# Altium project GenericPiHAT 06-1.0.PrjPCB
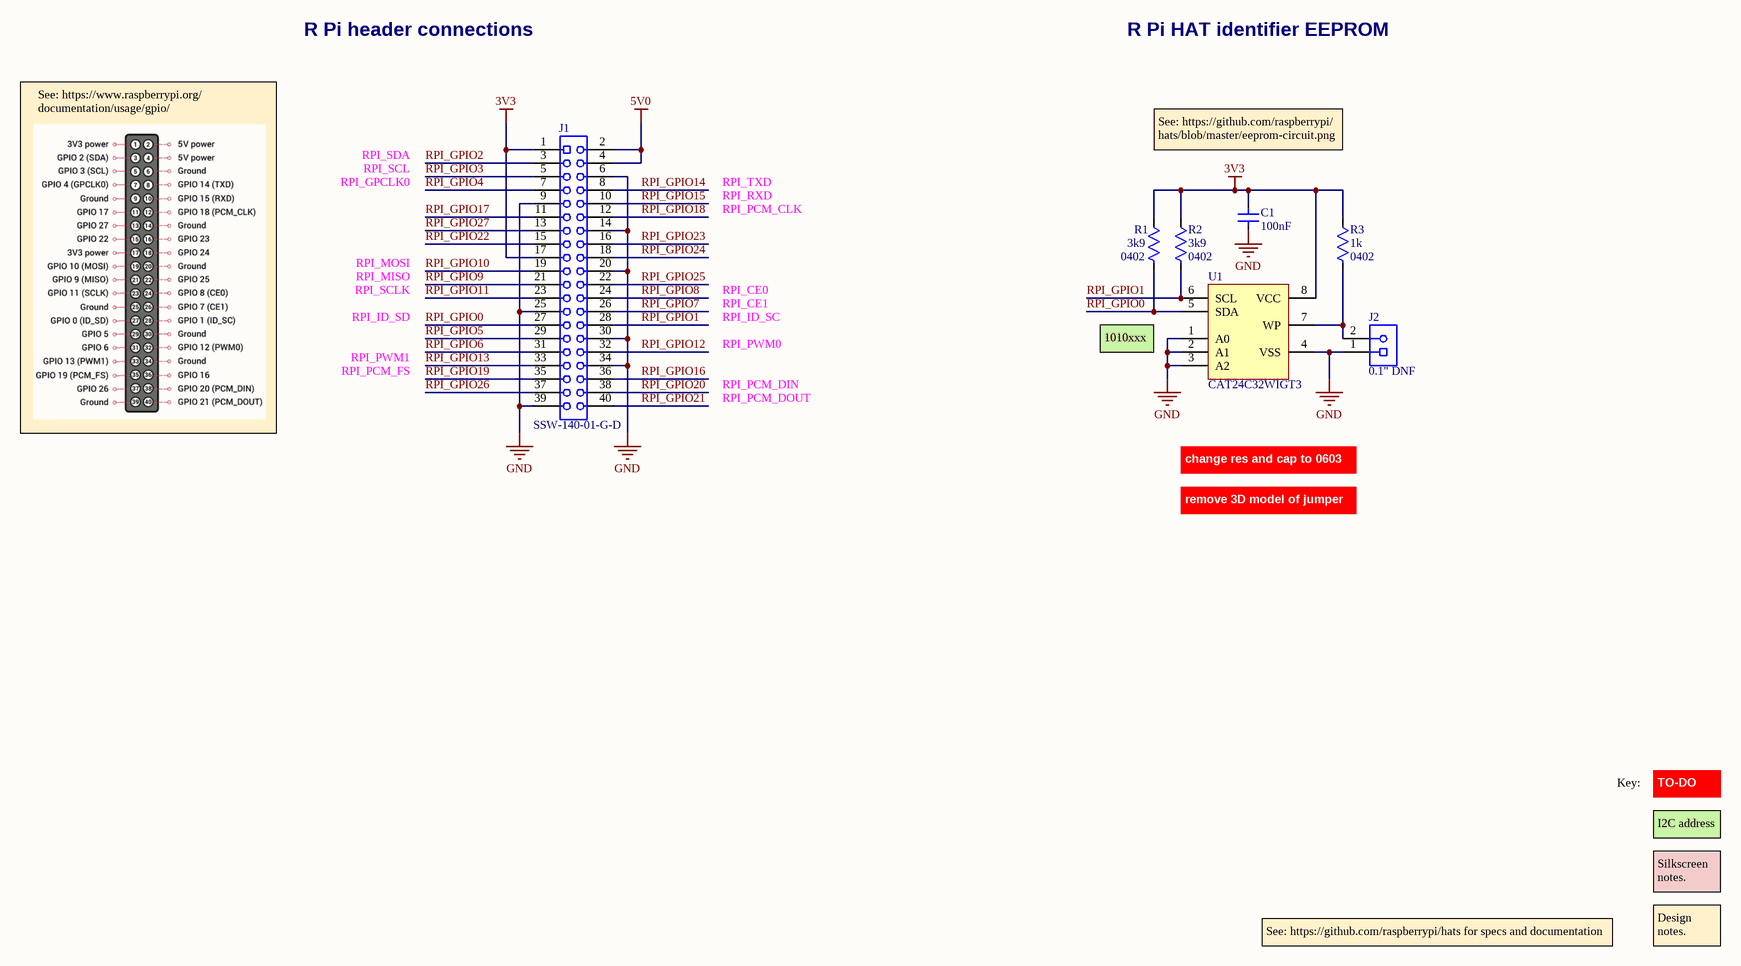
[diagram p0: GenericPiHAT 06-1.0.SchDoc]
ProjectCodeName: GenericPiHAT; ProjectCodenameDescription: Generic Rasberry Pi HAT; ProjectCodenameID: 06; ProjectDrawnBy: Steve Hodges; ProjectLicenceTerms: TBC; ProjectRevision: 1.0
1 sheet, 7 parts. Net scope: global (net labels, ports and power ports of the same name join across sheets).
Board file: GenericPiHAT 06-1.0.PcbDoc

## Sheet GenericPiHAT 06-1.0.SchDoc: whole design
size A3; DrawnBy: Steve Hodges; DocumentNumber: 1; Revision: 1.0; SheetNumber: 1; SheetTotal: 2; VersionControl_RevNumber: 1

### Parts
C1  100nF  [TDK 2010]
J1  SSW-140-01-G-D  [SSW-140-01-G-D]
J2  0.1" DNF  [Generic 1x2 2.54mm header]  (no BOM)
R1  Case: 0402  [RES0402]  (hidden comment: 3k9)
R2  Case: 0402  [RES0402]  (hidden comment: 3k9)
R3  Case: 0402  [RES0402]  (hidden comment: 1k)
U1  Manufacturer Part Number: CAT24C32WIGT3  [ONSC-SOIC-8-751BD-01_L]  (hidden comment: CAT24C32WI-GT3)

### Nets
3V3: C1.2 J1.1 J1.17 R1.1 R2.1 R3.1 U1.8(VCC)
5V0: J1.2 J1.4
GND: C1.1 J1.6 J1.9 J1.14 J1.20 J1.25 J1.30 J1.34 J1.39 J2.1 U1.1(A0) U1.2(A1) U1.3(A2) U1.4(VSS)
RPI_GPIO0: J1.27 R1.2 U1.5(SDA)
RPI_GPIO1: J1.28 R2.2 U1.6(SCL)
RPI_GPIO2: J1.3
RPI_GPIO3: J1.5
RPI_GPIO4: J1.7
RPI_GPIO5: J1.29
RPI_GPIO6: J1.31
RPI_GPIO7: J1.26
RPI_GPIO8: J1.24
RPI_GPIO9: J1.21
RPI_GPIO10: J1.19
RPI_GPIO11: J1.23
RPI_GPIO12: J1.32
RPI_GPIO13: J1.33
RPI_GPIO14: J1.8
RPI_GPIO15: J1.10
RPI_GPIO16: J1.36
RPI_GPIO17: J1.11
RPI_GPIO18: J1.12
RPI_GPIO19: J1.35
RPI_GPIO20: J1.38
RPI_GPIO21: J1.40
RPI_GPIO22: J1.15
RPI_GPIO23: J1.16
RPI_GPIO24: J1.18
RPI_GPIO25: J1.22
RPI_GPIO26: J1.37
RPI_GPIO27: J1.13
NetJ2_2: J2.2 R3.2 U1.7(WP)

### Notes on the sheet
- R Pi header connections
- R Pi HAT identifier EEPROM
- See: https://www.raspberrypi.org/
  documentation/usage/gpio/
- See: https://github.com/raspberrypi/
  hats/blob/master/eeprom-circuit.png
- RPI_SCL
- RPI_SDA
- RPI_GPCLK0
- RPI_TXD
- RPI_RXD
- RPI_PCM_CLK
- RPI_MOSI
- RPI_MISO
- RPI_ID_SD
- RPI_SCLK
- RPI_PWM0
- RPI_ID_SC
- RPI_CE0
- RPI_CE1
- 1010xxx
- RPI_PCM_FS
- RPI_PWM1
- RPI_PCM_DOUT
- RPI_PCM_DIN
- change res and cap to 0603
- remove 3D model of jumper
- Key:
- TO-DO
- Silkscreen notes.
- I2C address
- See: https://github.com/raspberrypi/hats for specs and documentation
- Design notes.
- Microsoft
- PROJECT DESCRIPTION
- SHEET DESCRIPTION
- SHEET FILENAME
- PROJECT FILENAME
- PROJECT CODENAME
- LICENCE
- LAST MODIFIED
- PAGE
- OF
- DRAWN BY
- REVISION
- PCB ID

### Library data of the parts
C1 = 100nF 0201 10V: CAP CER 0.1UF 10V X5R 0201; Manufacturer: TDK Corporation; Manufacturer Part Number: C0603X5R1A104K030BC; Capacitance: 0.10µF; Tolerance: ±10%; Supplier 1: Digi-Key; RoHS: RoHS Compliant; Category: Capacitors; Stock 1: 6306784; Pricing 1: 1=0.07, 10=0.034, 100=0.0157, 250=0.01288, 500=0.01102, 1000=0.00858, 5000=0.00715 (GBP); Packaging: Cut Tape (CT); Voltage - Rated: 10V; Temperature Coefficient: X5R; Mounting Type: Surface Mount, MLCC; Operating Temperature: -55°C ~ 85°C; Applications: General Purpose; Ratings: -; Package / Case: 0201 (0603 Metric); Size / Dimension: 0.024" L x 0.012" W (0.60mm x 0.30mm); Height - Seated (Max): -; Thickness (Max): 0.013" (0.33mm); Lead Spacing: -; Features: Low ESL; Lead Style: -; ComponentLink1URL: https://product.tdk.com/info/en/catalog/datasheets/mlcc_commercial_general_en.pdf; ComponentLink1Description: https://product.tdk.com/info/en/catalog/datasheets/mlcc_commercial_general_en.pdf; Supplier Part Number 1: 445-7318-1-ND
J1 = SSW-140-01-G-D: CONN RCPT .100" 40POS DUAL; Manufacturer: Samtec; Gender: Receptacle; Number of Contacts: 80; Contact Resistance: 10mR; Current Rating: 6.9A; Voltage Rating: 550V; Connector Type: Receptacle,Socket; Pitch: 2.54mm; Row Spacing: 0.1inch; Supplier 1: Digi-Key; Stock 1: 0; Pricing 1: 1=9.87000, 10=9.44100, 25=8.58240, 50=8.15320, 100=7.93870, 250=7.08048, 500=6.65136 (USD); RoHS: Yes; Mount: Through Hole; Contact Plating: Gold; Contact Material: Bronze; Color: Black; Housing Color: Black; Housing Material: Plastic; Min Operating Temperature: -55°C; Max Operating Temperature: 125°C; Number of Rows: 2; Packaging: Bulk; Termination: Solder; Max Voltage Rating (AC): 550V; Max Current Rating: 6.9A; Number of Positions: 80; Orientation: Straight; Radiation Hardening: No; REACH SVHC: No SVHC; Lead Free: Lead Free; Supplier 2: Farnell; Supplier 3: Mouser; Supplier 4: RSComponents; Supplier Part Number 1: SAM1208-40-ND; Supplier Part Number 2: 1668412; Supplier Part Number 3: 200-SSW14001GD; Supplier Part Number 4: 7655859; ComponentLink1Description: samtec catalogue page online; ComponentLink1URL: http://suddendocs.samtec.com/catalog_english/ssw_th.pdf; ComponentLink2Description: samtec drawing online; ComponentLink2URL: http://suddendocs.samtec.com/prints/ssw-1xx-xx-xxx-x-xx-xxx-xx-mkt.pdf; Manufacturer Part Number: SSW-140-01-G-D
J2 = Header Multicomp 2211S-02G-whitesch: 2.54mm, 2x1 way, vertical, square pin, gold plate; Supplier 1: Farnell; Manufacturer: MULTICOMP; Manufacturer Part Number: 2211S-02G; RoHS: YES; Stock 1: 168174; Pricing 1: 100=0.0203, 500=0.0146, 1000=0.0122, 2500=0.011, 5000=0.0099, 10000=0.0086 (GBP); ComponentLink1URL: http://www.farnell.com/datasheets/1518407.pdf; ComponentLink1Description: header strip datasheet; Supplier Part Number 1: 1593411
R1 R2 = RES0402_GENERIC: Generic 0402 Chip Resistor 3k9; Value: 3k9
R3 = RES0402_GENERIC: Generic 0402 Chip Resistor 1k; Value: 1k
U1 = CAT24C32WI-GT3: Manufacturer: ON Semiconductor; Interface: I2C,Serial,2-Wire; Frequency: 400kHz; Memory Type: EEPROM; Min Supply Voltage: 1.7V; Max Supply Voltage: 5.5V; Access Time: 3500ns; Nominal Supply Current: 2mA; Density: 32Kb; Number of Words: 4096; Operating Supply Voltage: 5V; Max Frequency: 100kHz; Supplier 1: Digi-Key; Stock 1: 37111; Pricing 1: 1=0.200000, 10=0.197000, 100=0.161900, 500=0.157360, 1000=0.153150 (USD); RoHS: Yes; Mount: Surface Mount; Case/Package: SOIC; Number of Pins: 8; Contact Plating: Gold; Min Operating Temperature: -40°C; Max Operating Temperature: 85°C; Package Quantity: 1; Packaging: Tape and Reel; Memory Size: 32Kb; Length: 5mm; Height: 1.5mm; Width: 4mm; Radiation Hardening: No; Lead Free: Lead Free; REACH SVHC: No SVHC; Halogen Free: Halogen Free; Supplier 2: Farnell; Supplier 3: Mouser; Supplier 4: RSComponents; Supplier Part Number 1: CAT24C32WI-GT3CT-ND; Supplier Part Number 2: 2306646; Supplier Part Number 3: 698-CAT24C32WI-GT3; Supplier Part Number 4: 7814828; ComponentLink1Description: On Semi datasheet online; ComponentLink1URL: https://www.onsemi.com/pub/Collateral/CAT24C32-D.PDF